# Altium schematic sheet Power Circuit.SchDoc
size A4; SheetNumber: 3; SheetTotal: 8
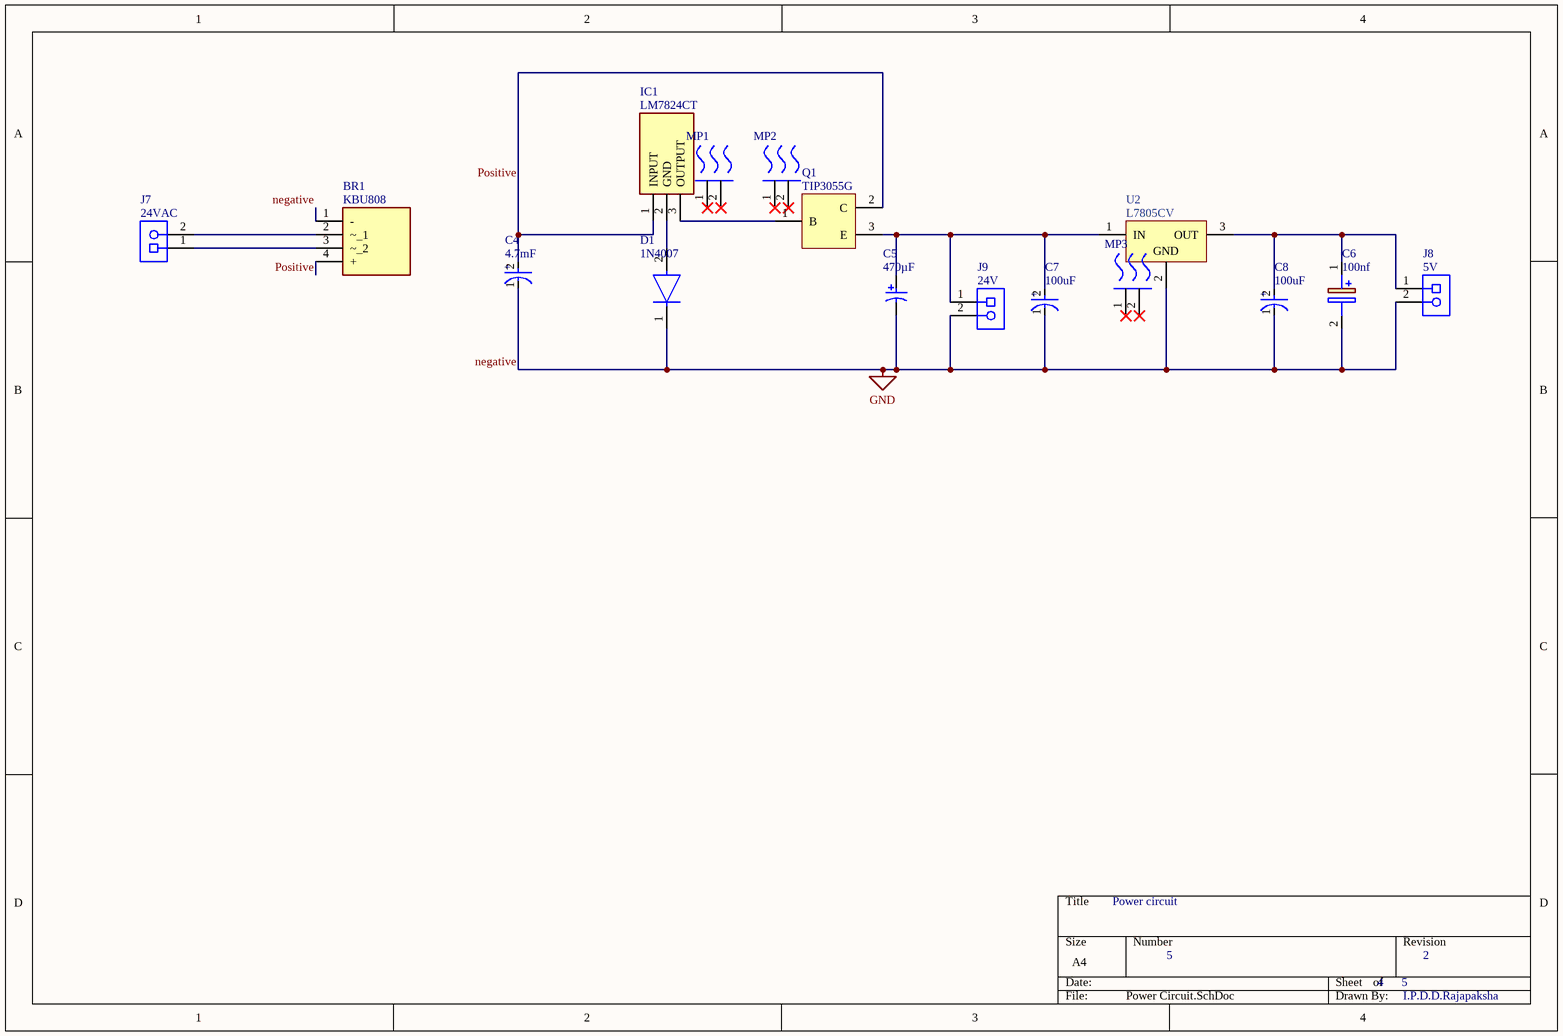
[diagram p0: Power Circuit.SchDoc]

## Parts
BR1  KBU808  [KBU808]
C4  Capacitance: 4.7mF  [FP-RAD-TH-D_18_0_5-L_35_5-MFG]  (hidden comment: ECA1VHG472)
C5  Capacitance: 470µF  [PNSC-CAP-10x20-P2]  (hidden comment: ECA-1HHG471)
C6  Parameter 1: 100nf  [CAPPRD150W50D400H600]  (hidden comment: ECEA1HKS0R1)
C7  Capacitance: 100uF  [FP-EEU-FR1H101B-MFG]  (hidden comment: EEU-FR1H101B)
C8  Capacitance: 100uF  [FP-EEU-FR1H101B-MFG]  (hidden comment: EEU-FR1H101B)
D1  1N4007  [FP-1N4007-MFG]
IC1  LM7824CT  [TO254P470X1028X1955-3P]
J7  Parameter 1: 24VAC  [PHOE-1729128-2_V]  (hidden comment: 1729128)
J8  Parameter 1: 5V  [PHOE-1729128-2_V]  (hidden comment: 1729128)
J9  Parameter 1: 24V  [PHOE-1729128-2_V]  (hidden comment: 1729128)
MP1  WV-T264-101E  [FP-WV-T264-101E-MFG]  (value not drawn)
MP2  WV-T264-101E  [FP-WV-T264-101E-MFG]  (value not drawn)
MP3  WV-T264-101E  [FP-WV-T264-101E-MFG]  (value not drawn)
Q1  TIP3055G  [ONSC-TO-247-3-340L-02]
U2  L7805CV  [TO220]

## Nets
negative: BR1.1(-) C4.1(C) C5.2 C6.2(-) C7.1(C) C8.1(C) D1.1(C) J8.2 J9.2 U2.2(GND)  [also labelled GND]
Positive: BR1.4(+) C4.2(A) IC1.1(INPUT) Q1.2(C)
NetBR1_2: BR1.2(~_1) J7.2
NetBR1_3: BR1.3(~_2) J7.1
NetC5_1: C5.1 C7.2(A) J9.1 Q1.3(E) U2.1(IN)
NetC6_1: C6.1(+) C8.2(A) J8.1 U2.3(OUT)
NetD1_2: D1.2(A) IC1.2(GND)
NetIC1_3: IC1.3(OUTPUT) Q1.1(B)

Not connected (* = marked no-connect by the designer): MP1 1(MNT_1)* 2(MNT_2)*; MP2 1(MNT_1)* 2(MNT_2)*; MP3 1(MNT_1)* 2(MNT_2)*

## Notes on the sheet
- Power circuit
- 5
- 4      5
- 2
- I.P.D.D.Rajapaksha
- (in symbol CMP-05427-000020-1) +
- (in symbol CMP-05427-001627-1) +

## Library data of the parts
BR1 = KBU808: Bridge Rectifier; Manufacturer_Name: MDD; Datasheet Link: https://datasheet.lcsc.com/szlcsc/MDD-Jiangsu-Yutai-Elec-KBU808_C3087.pdf; Height: 19.8mm; Manufacturer_Part_Number: KBU808
C4 = CMP-05427-001627-1: Aluminum Electrolytic Capacitors (Radial Lead Type) AEC-Q200 Qualified 4700uF ±20% 35V; Leakage Current: 3uA; Life (Hours): 2000Hour; Lead Diameter: 0.8mm; Dissipation Factor: 0.2%; Lead/Base Style: Straight; Ripple Current: 1.91A; Packaging: Bulk; RoHS Compliant: Yes; Number of Pins: 2; Radiation Hardening: No; Features: General Purpose; Mount: Through Hole; Voltage Rating (DC): 35V; Construction: RADIAL; Min Operating Temperature: -55°C; Voltage Rating: 35V; Contact Plating: Tin; Height - Seated (Max): 1.398inch; Termination: Radial; Series: NHG; Lead Pitch: 7.5mm; Diameter: 18mm; Voltage: 35V; Package Quantity: 50; Height: 35.5mm; Max Operating Temperature: 105°C; REACH SVHC: No SVHC; Length: 35.5mm; Case/Package: Radial; Tolerance: 20%; Ripple Current (AC): 1.91A
C5 = CMP-2000-05308-1: Aluminum Electrolytic Capacitor, 470 uF, +/- 20%, 50 V, -55 to 105 degC, 2-Pin THD, RoHS, Bulk; Manufacturer: Panasonic; Package Version: Nov-12; Type: Radial; Lifetime@Temperature: 2000Hrs@105degC; Rated Voltage: 50V; Ripple Current: 530mA; Case Size/Dimension: Ø10x20mm; Package Reference: CAP-10x20-P2; Package Description: 2-Pin Through Hole Device, Dia 10 mm, Body Length 20 mm, Pin Spacing 5 mm; Series: NHG; Datasheet Version: Nov-12; Datasheet URL: http://www.alliedelec.com/images/products/datasheets/bm/Panasonic/70067776.pdf; Package URL: http://www.alliedelec.com/images/products/datasheets/bm/Panasonic/70067776.pdf; Operating Temp-Max: 105degC; Operating Temp Range: -55to+105degC; Manufacturer URL: http://www.panasonic.com/
C6 = ECEA1HKS0R1: Capacitor Polarised; Manufacturer_Name: Panasonic; Datasheet Link: https://componentsearchengine.com/Datasheets/2/ECEA1HKS0R1.pdf; Height: 6mm; Manufacturer_Part_Number: ECEA1HKS0R1
C7 C8 = CMP-05427-000020-1: CAP ALUM 100UF 20% 50V RADIAL; Life (Hours): 6000Hour; Ripple Current: 870mA; Lead Diameter: 0.6mm; Impedance: 61mR; Tolerance: 20%; Mount: Through Hole; Lead Free: Lead Free; Length: 11.5mm; Height - Seated (Max): 0.512inch; Contact Plating: Tin; Termination: Radial; Series: FR; Max Operating Temperature: 105°C; Features: General Purpose; Min Operating Temperature: -40°C; RoHS Compliant: Yes; Height: 11.5mm; Voltage Rating (DC): 50V; Diameter: 8mm; Lead Pitch: 5mm; Radiation Hardening: No; Package Quantity: 1; Case/Package: Radial; Voltage Rating: 50V; Packaging: Tape and Reel; ESR (Equivalent Series Resistance): 61mR; REACH SVHC: No SVHC
D1 = CMP-123542-000001-1: Rectifier diode 1000 V 1 A DO-41, ,; Manufacturer: Diotec; Max Surge Forward Current: 27A; Forward Current: 1A; Max Junction Temp: +175°C; Reverse Voltage: 1000V; Value: 15pF; Peak Reverse Current: 5uA; Category: Diode; Temperature Range Low: -50°C; Automotive: No; Temperature: -50°C to +175°C; Lead Free: Yes; ComponentLink2Description: Datasheet; Max Repetitive Reverse Voltage: 1000V; ComponentLink2URL: https://datasheet.octopart.com/1N4007-Diotec-datasheet-62346875.pdf; Manufacturer Part Number: 1N4007; Device Class L3: Rectifier Diodes; Height: 2.8mm; Octopart: https://octopart.com/1n4007-diotec-4040411; Package: 1N4007; Temperature Range High: +175°C; Device Class L1: Discrete Semiconductors; Device Class L2: Diodes; RoHS: TRUE; Capacitance: 15pF; Ipc Land Pattern Name: DIOAD888W100L520D280
IC1 = LM7824CT: Integrated Circuit; Manufacturer_Name: Texas Instruments; Datasheet Link: https://media.digikey.com/pdf/Data%20Sheets/National%20Semiconductor%20PDFs/LM140,LM340(A).LM7800C.pdf; Height: 4.7mm; Manufacturer_Part_Number: LM7824CT; Mouser Part Number: N/A; Mouser Price/Stock: https://www.mouser.co.uk/ProductDetail/Texas-Instruments/LM7824CT?qs=9V2QonpqdTsSUSVcEBRo9w%3D%3D
J7-J9 = CMP-2000-05815-1: PCB Terminal Block, 13.5 A, 400 V, 2-Pin THD, RoHS, Bulk; Manufacturer: Phoenix Contact; Package Version: 03/2015; No. of Rows: 1; Pitch: 5.08mm; No. of Positions: 2; Voltage Rating: 400V; Current Rating: 13500mA; Manufacturer URL: http://www.phoenixcontact.com/; Datasheet URL: https://datasheet.ciiva.com/16046/1729128-16046181.pdf; RoHS: TRUE; Package URL: https://www.phoenixcontact.com/online/portal/pi/pxc/product_detail_page/!ut/p/b1/3VdJjqNKFDxLH8AFycySyWY2ozFsEPOMMQaDOX1XedGL_1Vdm5YXJleknhSKeBkvI6EA8ncAo3AYoDhBQGco6KN7VURTdemj9us_IEKEZo_YHiPAEWEFmDGOHMORkqKYCORBZxgL7ZoaZYcbFFUZ3fqxSY6GOuxydWUuHqz1ynmMFygu583Bob0Ewr6Sd_l-5m-kAueHiB0jpRwZwe58wwtkpxtMYd_LmGcDRU02dRNEyWt6Y2ti5pSyJ_reIkzIulrqApdnbT11V5jnCKbYNCvhEM1MCpPByat_X379-iThf08CI5GfOPqfBeS3BRoBOdD55AKVv0iLwCMq-2BrzXWSGRH7pUGD9uwXQjiph3xL0DKQwdGa0JImiIOmBNOestqgwTHSSs2oOep-78apyXQBvNi8ZLaFjvjWvcaUEBu0MC6Wbe-d6mB0FAebo2lUWinqYaZs5DAYzV0RP9yitUjnGJ0iI9xhZkT42OCQNUJJhkgWINNQLP2JFP6OpMg3JCVg70jqHT0lvKOnhHf0lPuOnnLf0VPuWx6_dxwUIvwk5WMkT0kLL1mh61l2yZVSzG3pYV_bqo-mj6uMKwKwdnnW8Jh5RTOJzMOA5c-eJDaZQw4mTMPH02PvS_ZAqNVjVTo2WyYLkwH_KU1mmmG5kjRhDqPXLwwVHvVOjCM60-fpXvTDfMGW1PVFVS1r4e4yVDk4ZdNbkUHvqPqQSeian4UD39fNKmachqdJ1NJbyk8rXT9mXTvPk3oE5meulKGgiruPJek-4I9hTT6G8ZLOyRSm2RRVbThERQad5OS28hdt4YW4vG0stgYYzsWsK4_7y6DZMjJSCqri1kyiZR5vD7pwIrNR7QwPHTcLTI5qT7eRlpHrdGiupYlqQDJ7zy_CND8fWWBoLRXxk1RVcXiBQwbTD4Xi7KL-FuO94t9xaqweXzH; PartNumber: 1729128; Package Description: 2-Pin Through Hole Device, Body 8.1 x 10.16 mm, Pitch 5.08 mm; Datasheet Version: 12/2013; Mounting Technology: ThroughHole; Orientation: Horizontal; Package Reference: 1729128-2; Packing: Bulk
MP1-MP3 = CMP-33535-000032-1: HEATSINK W/CLIP FOR TO-264; Natural Thermal Resistance: 12°C/W; Shape: Fins; Thermal Resistance @ Forced Air Flow (100 LFM): 8°C/W; Width: 23.4mm; Weight: 0.42oz; Package Quantity: 10; RoHS Compliant: Yes; Mount: Clip; Package Cooled: TO-264; Height Off Base: 0.63inch; Height: 32mm; Packaging: Bulk; Series: W; Case/Package: TO-264; Length: 1.26inch; Material: Aluminium
Q1 = CMP-1048-01314-1: Complementary Silicon Power Transistor, 3-Pin TO-247, Pb-Free, Tube; Manufacturer: On Semiconductor; Polarity: NPN; fT Min (MHz): 2.5; IC Continuous (A): 15; ComponentLink3URL: http://www.onsemi.cn/pub_link/Collateral/340L-02.PDF; ComponentLink3Description: Package Specification; RoHS: TRUE; PackageDescription: 3-Pin Flange Mount, Vertical Straight Lead, Body 16.005 x 5 mm, Pitch 5.45 mm; PackageVersion: Rev. F, 10/2011; ComponentLink1Description: Manufacturer URL; PackageReference: TO-247-3-340L-02; DatasheetVersion: Rev. 7; ComponentLink2Description: Datasheet; Packing: Tube; Mounting Technology: Through Hole; ComponentLink1URL: http://www.onsemi.com/; ComponentLink2URL: http://www.onsemi.com/pub_link/Collateral/TIP3055-D.PDF; PartNumber: TIP3055G
U2 = CMP-0244-00483-1: Positive Voltage Regulator, 5V, 3-Pin TO-220; PackageDescription: TO, Thru-Hole, Vertical, Heatsink Mounted; 3 In-Line Leads; Pitch 2.54 mm; ComponentLink2Description: Datasheet; PackageReference: TO220; ComponentLink3URL: http://www.st.com/internet/com/TECHNICAL_RESOURCES/TECHNICAL_LITERATURE/PACKAGE_INFORMATION/CD00004649.pdf; DatasheetVersion: 16/11/2011; ComponentLink1Description: Manufacturer URL; ComponentLink1URL: http://www.st.com; PackageVersion: ver3.0; ComponentLink3Description: Package Specification; ComponentLink2URL: http://www.st.com/internet/com/TECHNICAL_RESOURCES/TECHNICAL_LITERATURE/DATASHEET/CD00000444.pdf